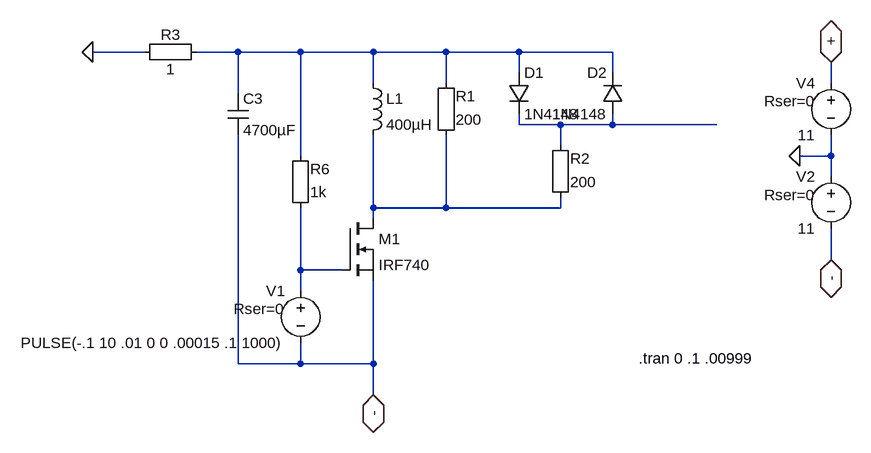
[diagram p0: schematic meat_haw_20.asc]
meat_haw_20.asc, the LTspice schematic file:
Version 4
SHEET 1 4676 1612
WIRE -112 -2400 -192 -2400
WIRE 32 -2400 -32 -2400
WIRE 128 -2400 32 -2400
WIRE 240 -2400 128 -2400
WIRE 352 -2400 240 -2400
WIRE 464 -2400 352 -2400
WIRE 608 -2400 464 -2400
WIRE 464 -2368 464 -2400
WIRE 608 -2368 608 -2400
WIRE 240 -2352 240 -2400
WIRE 352 -2352 352 -2400
WIRE 944 -2352 944 -2384
WIRE 32 -2336 32 -2400
WIRE 464 -2288 464 -2304
WIRE 528 -2288 464 -2288
WIRE 608 -2288 608 -2304
WIRE 608 -2288 528 -2288
WIRE 768 -2288 608 -2288
WIRE 528 -2256 528 -2288
WIRE 128 -2240 128 -2400
WIRE 944 -2240 944 -2272
WIRE 944 -2240 896 -2240
WIRE 944 -2208 944 -2240
WIRE 240 -2160 240 -2272
WIRE 352 -2160 352 -2272
WIRE 352 -2160 240 -2160
WIRE 528 -2160 528 -2176
WIRE 528 -2160 352 -2160
WIRE 240 -2144 240 -2160
WIRE 944 -2080 944 -2128
WIRE 128 -2064 128 -2160
WIRE 192 -2064 128 -2064
WIRE 128 -2032 128 -2064
WIRE 32 -1920 32 -2272
WIRE 128 -1920 128 -1952
WIRE 128 -1920 32 -1920
WIRE 240 -1920 240 -2048
WIRE 240 -1920 128 -1920
WIRE 240 -1872 240 -1920
FLAG 240 -1872 -
IOPIN 240 -1872 BiDir
FLAG 944 -2080 -
IOPIN 944 -2080 BiDir
FLAG 944 -2384 +
IOPIN 944 -2384 BiDir
FLAG 896 -2240 0
FLAG -192 -2400 0
SYMBOL Misc\\EuropeanCap 16 -2336 R0
SYMATTR InstName C3
SYMATTR Value 4700µF
SYMATTR SpiceLine V=400 Irms=1 Rser=.32 Lser=0
SYMBOL ind 224 -2368 R0
SYMATTR InstName L1
SYMATTR Value 400µH
SYMBOL Misc\\EuropeanResistor 336 -2256 M180
WINDOW 0 31 76 Left 2
WINDOW 3 31 40 Left 2
SYMATTR InstName R1
SYMATTR Value 200
SYMBOL Misc\\EuropeanResistor 512 -2160 M180
WINDOW 0 31 76 Left 2
WINDOW 3 31 40 Left 2
SYMATTR InstName R2
SYMATTR Value 200
SYMBOL diode 448 -2368 R0
SYMATTR InstName D1
SYMATTR Value 1N4148
SYMBOL diode 624 -2304 R180
WINDOW 0 24 64 Left 2
WINDOW 3 24 0 Left 2
SYMATTR InstName D2
SYMATTR Value 1N4148
SYMBOL Misc\\EuropeanResistor -128 -2416 M90
WINDOW 0 5 56 VBottom 2
WINDOW 3 27 56 VTop 2
SYMATTR InstName R3
SYMATTR Value 1
SYMBOL nmos 192 -2144 R0
SYMATTR InstName M1
SYMATTR Value IRF740
SYMBOL voltage 128 -2048 M0
WINDOW 123 0 0 Left 2
WINDOW 39 24 44 Left 2
SYMATTR SpiceLine Rser=0
SYMATTR InstName V1
SYMATTR Value PULSE(-.1 10 .01 0 0 .00015 .1 1000)
SYMBOL Misc\\EuropeanResistor 112 -2144 M180
WINDOW 0 31 76 Left 2
WINDOW 3 31 40 Left 2
SYMATTR InstName R6
SYMATTR Value 1k
SYMBOL voltage 944 -2224 M0
WINDOW 123 0 0 Left 2
WINDOW 39 24 44 Left 2
SYMATTR SpiceLine Rser=0
SYMATTR InstName V2
SYMATTR Value 11
SYMBOL voltage 944 -2368 M0
WINDOW 123 0 0 Left 2
WINDOW 39 24 44 Left 2
SYMATTR SpiceLine Rser=0
SYMATTR InstName V4
SYMATTR Value 11
TEXT 648 -1928 Left 2 !.tran 0 .1 .00999

The netlist it stands for:
* meat_haw_20.asc
C3 N001 - 4700µF V=400 Irms=1 Rser=.32 Lser=0
L1 N001 N003 400µH
R1 N003 N001 200
R2 N003 N002 200
D1 N001 N002 1N4148
D2 N002 N001 1N4148
R3 0 N001 1
M1 N003 N004 - - IRF740
V1 N004 - PULSE(-.1 10 .01 0 0 .00015 .1 1000) Rser=0
R6 N004 N001 1k
V2 0 - 11 Rser=0
V4 + 0 11 Rser=0
.model D D
.lib standard.dio
.model NMOS NMOS
.model PMOS PMOS
.lib standard.mos
.tran 0 .1 .00999
.backanno
.end